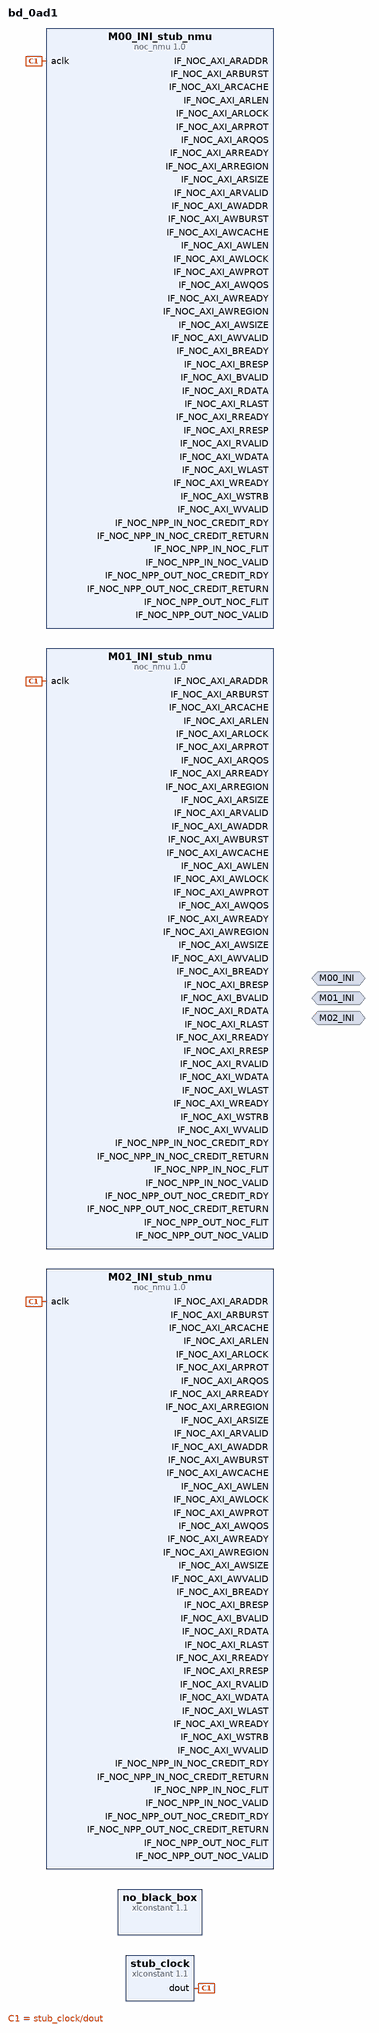
[diagram p0: block diagram of the top level]
# Vivado block design bd_0ad1, xcvc1902-vsvd1760-2MP-e-S, Vivado 2022.2
create_bd_design bd_0ad1

create_bd_intf_port -mode Master -vlnv xilinx.com:interface:inimm_rtl:1.0 M00_INI
set_property -dict {CONFIG.INI_STRATEGY load} [get_bd_intf_ports M00_INI]
create_bd_intf_port -mode Master -vlnv xilinx.com:interface:inimm_rtl:1.0 M01_INI
set_property -dict {CONFIG.INI_STRATEGY load} [get_bd_intf_ports M01_INI]
create_bd_intf_port -mode Master -vlnv xilinx.com:interface:inimm_rtl:1.0 M02_INI
set_property -dict {CONFIG.INI_STRATEGY load} [get_bd_intf_ports M02_INI]

create_bd_cell -type ip -vlnv xilinx.com:ip:noc_nmu:1.0 M02_INI_stub_nmu
set_property -dict [list \
  CONFIG.ATTR_FILE nocattrs.dat \
  CONFIG.NOC_FREQ 1000 \
  CONFIG.USER_PHYS_NAME NOC_NMU512_X3Y0 \
  CONFIG.USER_REG_ADDR_DST0 0x00000 \
  CONFIG.USER_REG_ADDR_DST1 0x00000 \
  CONFIG.USER_REG_ADDR_DST2 0x00000 \
  CONFIG.USER_REG_ADDR_DST3 0x00000 \
  CONFIG.USER_REG_ADDR_DST4 0x00000 \
  CONFIG.USER_REG_ADDR_DST5 0x00000 \
  CONFIG.USER_REG_ADDR_DST6 0x00000 \
  CONFIG.USER_REG_ADDR_DST7 0x00000 \
  CONFIG.USER_REG_ADDR_DST8 0x00000 \
  CONFIG.USER_REG_ADDR_DST9 0x00000 \
  CONFIG.USER_REG_ADDR_DST10 0x00000 \
  CONFIG.USER_REG_ADDR_DST11 0x00000 \
  CONFIG.USER_REG_ADDR_DST12 0x00000 \
  CONFIG.USER_REG_ADDR_DST13 0x00000 \
  CONFIG.USER_REG_ADDR_DST14 0x00000 \
  CONFIG.USER_REG_ADDR_DST15 0x00000 \
  CONFIG.USER_REG_ADDR_ENABLE 0x0000 \
  CONFIG.USER_REG_ADDR_MADDR0 0x00000000 \
  CONFIG.USER_REG_ADDR_MADDR1 0x00000000 \
  CONFIG.USER_REG_ADDR_MADDR2 0x00000000 \
  CONFIG.USER_REG_ADDR_MADDR3 0x00000000 \
  CONFIG.USER_REG_ADDR_MADDR4 0x00000000 \
  CONFIG.USER_REG_ADDR_MADDR5 0x00000000 \
  CONFIG.USER_REG_ADDR_MADDR6 0x00000000 \
  CONFIG.USER_REG_ADDR_MADDR7 0x00000000 \
  CONFIG.USER_REG_ADDR_MADDR8 0x00000000 \
  CONFIG.USER_REG_ADDR_MADDR9 0x00000000 \
  CONFIG.USER_REG_ADDR_MADDR10 0x00000000 \
  CONFIG.USER_REG_ADDR_MADDR11 0x00000000 \
  CONFIG.USER_REG_ADDR_MADDR12 0x00000000 \
  CONFIG.USER_REG_ADDR_MADDR13 0x00000000 \
  CONFIG.USER_REG_ADDR_MADDR14 0x00000000 \
  CONFIG.USER_REG_ADDR_MADDR15 0x00000000 \
  CONFIG.USER_REG_ADDR_MASK0 0x00000000 \
  CONFIG.USER_REG_ADDR_MASK1 0x00000000 \
  CONFIG.USER_REG_ADDR_MASK2 0x00000000 \
  CONFIG.USER_REG_ADDR_MASK3 0x00000000 \
  CONFIG.USER_REG_ADDR_MASK4 0x00000000 \
  CONFIG.USER_REG_ADDR_MASK5 0x00000000 \
  CONFIG.USER_REG_ADDR_MASK6 0x00000000 \
  CONFIG.USER_REG_ADDR_MASK7 0x00000000 \
  CONFIG.USER_REG_ADDR_MASK8 0x00000000 \
  CONFIG.USER_REG_ADDR_MASK9 0x00000000 \
  CONFIG.USER_REG_ADDR_MASK10 0x00000000 \
  CONFIG.USER_REG_ADDR_MASK11 0x00000000 \
  CONFIG.USER_REG_ADDR_MASK12 0x00000000 \
  CONFIG.USER_REG_ADDR_MASK13 0x00000000 \
  CONFIG.USER_REG_ADDR_MASK14 0x00000000 \
  CONFIG.USER_REG_ADDR_MASK15 0x00000000 \
  CONFIG.USER_REG_ADDR_REMAP 0x0000 \
  CONFIG.USER_REG_ADDR_RPADDR0 0x00000000 \
  CONFIG.USER_REG_ADDR_RPADDR1 0x00000000 \
  CONFIG.USER_REG_ADDR_RPADDR2 0x00000000 \
  CONFIG.USER_REG_ADDR_RPADDR3 0x00000000 \
  CONFIG.USER_REG_ADDR_RPADDR4 0x00000000 \
  CONFIG.USER_REG_ADDR_RPADDR5 0x00000000 \
  CONFIG.USER_REG_ADDR_RPADDR6 0x00000000 \
  CONFIG.USER_REG_ADDR_RPADDR7 0x00000000 \
  CONFIG.USER_REG_ADDR_RPADDR8 0x00000000 \
  CONFIG.USER_REG_ADDR_RPADDR9 0x00000000 \
  CONFIG.USER_REG_ADDR_RPADDR10 0x00000000 \
  CONFIG.USER_REG_ADDR_RPADDR11 0x00000000 \
  CONFIG.USER_REG_ADDR_RPADDR12 0x00000000 \
  CONFIG.USER_REG_ADDR_RPADDR13 0x00000000 \
  CONFIG.USER_REG_ADDR_RPADDR14 0x00000000 \
  CONFIG.USER_REG_ADDR_RPADDR15 0x00000000 \
  CONFIG.USER_REG_ADR_MAP_CPM 0x0FC0 \
  CONFIG.USER_REG_ADR_MAP_FPD_AFI_0 0x0FC0 \
  CONFIG.USER_REG_ADR_MAP_FPD_AFI_1 0x0FC0 \
  CONFIG.USER_REG_ADR_MAP_LPD_AFI_FS 0x0FC0 \
  CONFIG.USER_REG_ADR_MAP_ME_ARRAY_0 0x0FC0 \
  CONFIG.USER_REG_ADR_MAP_ME_ARRAY_1 0x0FC0 \
  CONFIG.USER_REG_ADR_MAP_ME_ARRAY_2 0x0FC0 \
  CONFIG.USER_REG_ADR_MAP_ME_ARRAY_3 0x0FC0 \
  CONFIG.USER_REG_ADR_MAP_PCIE 0x0FC0 \
  CONFIG.USER_REG_ADR_MAP_PMC 0x0FC0 \
  CONFIG.USER_REG_ADR_MAP_PMC_ALIAS_0 0x0FC0 \
  CONFIG.USER_REG_ADR_MAP_PMC_ALIAS_1 0x0FC0 \
  CONFIG.USER_REG_ADR_MAP_PMC_ALIAS_2 0x0FC0 \
  CONFIG.USER_REG_ADR_MAP_PMC_ALIAS_3 0x0FC0 \
  CONFIG.USER_REG_ADR_MAP_QSPI 0x0FC0 \
  CONFIG.USER_REG_ADR_MAP_STM_GIC 0x0FC0 \
  CONFIG.USER_REG_ADR_MAP_XPDS 0x0FC0 \
  CONFIG.USER_REG_AXI_LOOPBACK 0x00 \
  CONFIG.USER_REG_AXI_NON_MOD_DISABLE 0x0 \
  CONFIG.USER_REG_AXI_PAR_CHK 0x0 \
  CONFIG.USER_REG_CHOPSIZE 0xA \
  CONFIG.USER_REG_DDR_ADR_MAP0 0x06688 \
  CONFIG.USER_REG_DDR_ADR_MAP1 0x01FFF \
  CONFIG.USER_REG_DDR_ADR_MAP2 0x01FFF \
  CONFIG.USER_REG_DDR_ADR_MAP3 0x01FFF \
  CONFIG.USER_REG_DDR_ADR_MAP4 0x01FFF \
  CONFIG.USER_REG_DDR_ADR_MAP5 0x01FFF \
  CONFIG.USER_REG_DDR_ADR_MAP6 0x01FFF \
  CONFIG.USER_REG_DDR_DST_MAP0 0x900 \
  CONFIG.USER_REG_DDR_DST_MAP1 0x600 \
  CONFIG.USER_REG_DDR_DST_MAP2 0x800 \
  CONFIG.USER_REG_DDR_DST_MAP3 0x700 \
  CONFIG.USER_REG_DDR_DST_MAP4 0xFC0 \
  CONFIG.USER_REG_DDR_DST_MAP5 0xFC0 \
  CONFIG.USER_REG_DDR_DST_MAP6 0xFC0 \
  CONFIG.USER_REG_DDR_DST_MAP7 0xFC0 \
  CONFIG.USER_REG_DWIDTH 0x6 \
  CONFIG.USER_REG_ECC_CHK_EN 0x1 \
  CONFIG.USER_REG_HBM_MAP_T0_CH0 0x0FC0 \
  CONFIG.USER_REG_HBM_MAP_T0_CH1 0x0FC0 \
  CONFIG.USER_REG_HBM_MAP_T0_CH2 0x0FC0 \
  CONFIG.USER_REG_HBM_MAP_T0_CH3 0x0FC0 \
  CONFIG.USER_REG_HBM_MAP_T0_CH4 0x0FC0 \
  CONFIG.USER_REG_HBM_MAP_T0_CH5 0x0FC0 \
  CONFIG.USER_REG_HBM_MAP_T0_CH6 0x0FC0 \
  CONFIG.USER_REG_HBM_MAP_T0_CH7 0x0FC0 \
  CONFIG.USER_REG_HBM_MAP_T0_CH8 0x0FC0 \
  CONFIG.USER_REG_HBM_MAP_T0_CH9 0x0FC0 \
  CONFIG.USER_REG_HBM_MAP_T0_CH10 0x0FC0 \
  CONFIG.USER_REG_HBM_MAP_T0_CH11 0x0FC0 \
  CONFIG.USER_REG_HBM_MAP_T0_CH12 0x0FC0 \
  CONFIG.USER_REG_HBM_MAP_T0_CH13 0x0FC0 \
  CONFIG.USER_REG_HBM_MAP_T0_CH14 0x0FC0 \
  CONFIG.USER_REG_HBM_MAP_T0_CH15 0x0FC0 \
  CONFIG.USER_REG_HBM_MAP_T1_CH0 0x0FC0 \
  CONFIG.USER_REG_HBM_MAP_T1_CH1 0x0FC0 \
  CONFIG.USER_REG_HBM_MAP_T1_CH2 0x0FC0 \
  CONFIG.USER_REG_HBM_MAP_T1_CH3 0x0FC0 \
  CONFIG.USER_REG_HBM_MAP_T1_CH4 0x0FC0 \
  CONFIG.USER_REG_HBM_MAP_T1_CH5 0x0FC0 \
  CONFIG.USER_REG_HBM_MAP_T1_CH6 0x0FC0 \
  CONFIG.USER_REG_HBM_MAP_T1_CH7 0x0FC0 \
  CONFIG.USER_REG_HBM_MAP_T1_CH8 0x0FC0 \
  CONFIG.USER_REG_HBM_MAP_T1_CH9 0x0FC0 \
  CONFIG.USER_REG_HBM_MAP_T1_CH10 0x0FC0 \
  CONFIG.USER_REG_HBM_MAP_T1_CH11 0x0FC0 \
  CONFIG.USER_REG_HBM_MAP_T1_CH12 0x0FC0 \
  CONFIG.USER_REG_HBM_MAP_T1_CH13 0x0FC0 \
  CONFIG.USER_REG_HBM_MAP_T1_CH14 0x0FC0 \
  CONFIG.USER_REG_HBM_MAP_T1_CH15 0x0FC0 \
  CONFIG.USER_REG_HBM_MAP_T2_CH0 0x0FC0 \
  CONFIG.USER_REG_HBM_MAP_T2_CH1 0x0FC0 \
  CONFIG.USER_REG_HBM_MAP_T2_CH2 0x0FC0 \
  CONFIG.USER_REG_HBM_MAP_T2_CH3 0x0FC0 \
  CONFIG.USER_REG_HBM_MAP_T2_CH4 0x0FC0 \
  CONFIG.USER_REG_HBM_MAP_T2_CH5 0x0FC0 \
  CONFIG.USER_REG_HBM_MAP_T2_CH6 0x0FC0 \
  CONFIG.USER_REG_HBM_MAP_T2_CH7 0x0FC0 \
  CONFIG.USER_REG_HBM_MAP_T2_CH8 0x0FC0 \
  CONFIG.USER_REG_HBM_MAP_T2_CH9 0x0FC0 \
  CONFIG.USER_REG_HBM_MAP_T2_CH10 0x0FC0 \
  CONFIG.USER_REG_HBM_MAP_T2_CH11 0x0FC0 \
  CONFIG.USER_REG_HBM_MAP_T2_CH12 0x0FC0 \
  CONFIG.USER_REG_HBM_MAP_T2_CH13 0x0FC0 \
  CONFIG.USER_REG_HBM_MAP_T2_CH14 0x0FC0 \
  CONFIG.USER_REG_HBM_MAP_T2_CH15 0x0FC0 \
  CONFIG.USER_REG_HBM_MAP_T3_CH0 0x0FC0 \
  CONFIG.USER_REG_HBM_MAP_T3_CH1 0x0FC0 \
  CONFIG.USER_REG_HBM_MAP_T3_CH2 0x0FC0 \
  CONFIG.USER_REG_HBM_MAP_T3_CH3 0x0FC0 \
  CONFIG.USER_REG_HBM_MAP_T3_CH4 0x0FC0 \
  CONFIG.USER_REG_HBM_MAP_T3_CH5 0x0FC0 \
  CONFIG.USER_REG_HBM_MAP_T3_CH6 0x0FC0 \
  CONFIG.USER_REG_HBM_MAP_T3_CH7 0x0FC0 \
  CONFIG.USER_REG_HBM_MAP_T3_CH8 0x0FC0 \
  CONFIG.USER_REG_HBM_MAP_T3_CH9 0x0FC0 \
  CONFIG.USER_REG_HBM_MAP_T3_CH10 0x0FC0 \
  CONFIG.USER_REG_HBM_MAP_T3_CH11 0x0FC0 \
  CONFIG.USER_REG_HBM_MAP_T3_CH12 0x0FC0 \
  CONFIG.USER_REG_HBM_MAP_T3_CH13 0x0FC0 \
  CONFIG.USER_REG_HBM_MAP_T3_CH14 0x0FC0 \
  CONFIG.USER_REG_HBM_MAP_T3_CH15 0x0FC0 \
  CONFIG.USER_REG_MODE_SELECT 0x0000 \
  CONFIG.USER_REG_OUTSTANDING_RD_TXN 0x40 \
  CONFIG.USER_REG_OUTSTANDING_WR_TXN 0x40 \
  CONFIG.USER_REG_PRIORITY 0x0 \
  CONFIG.USER_REG_RD_AXPROT_SEL 0x00 \
  CONFIG.USER_REG_RD_RATE_CREDIT_DROP 0x004 \
  CONFIG.USER_REG_RD_RATE_CREDIT_LIMIT 0x0100 \
  CONFIG.USER_REG_RD_VCA_TOKEN0 0x14 \
  CONFIG.USER_REG_RPOISON_TO_SLVERR 0x0 \
  CONFIG.USER_REG_RROB_RAM_SETTING 0x012 \
  CONFIG.USER_REG_SMID_SEL 0x00000 \
  CONFIG.USER_REG_SRC 0x200 \
  CONFIG.USER_REG_TBASE_AXI_TIMEOUT 0x1 \
  CONFIG.USER_REG_TBASE_MODE_RLIMIT_RD 0x2 \
  CONFIG.USER_REG_TBASE_MODE_RLIMIT_WR 0x2 \
  CONFIG.USER_REG_TBASE_TRK_TIMEOUT 0x1 \
  CONFIG.USER_REG_VC_MAP 0x688 \
  CONFIG.USER_REG_WBUF_LAUNCH_SIZE 0x10 \
  CONFIG.USER_REG_WBUF_RAM_SETTING 0x012 \
  CONFIG.USER_REG_WR_AXPROT_SEL 0x00 \
  CONFIG.USER_REG_WR_RATE_CREDIT_DROP 0x004 \
  CONFIG.USER_REG_WR_RATE_CREDIT_LIMIT 0x0100 \
  CONFIG.USER_REG_WR_VCA_TOKEN0 0xFF \
] [get_bd_cells M02_INI_stub_nmu]
create_bd_cell -type ip -vlnv xilinx.com:ip:noc_nmu:1.0 M00_INI_stub_nmu
set_property -dict [list \
  CONFIG.ATTR_FILE nocattrs.dat \
  CONFIG.NOC_FREQ 1000 \
  CONFIG.USER_PHYS_NAME NOC_NMU512_X0Y0 \
  CONFIG.USER_REG_ADDR_DST0 0x00000 \
  CONFIG.USER_REG_ADDR_DST1 0x00000 \
  CONFIG.USER_REG_ADDR_DST2 0x00000 \
  CONFIG.USER_REG_ADDR_DST3 0x00000 \
  CONFIG.USER_REG_ADDR_DST4 0x00000 \
  CONFIG.USER_REG_ADDR_DST5 0x00000 \
  CONFIG.USER_REG_ADDR_DST6 0x00000 \
  CONFIG.USER_REG_ADDR_DST7 0x00000 \
  CONFIG.USER_REG_ADDR_DST8 0x00000 \
  CONFIG.USER_REG_ADDR_DST9 0x00000 \
  CONFIG.USER_REG_ADDR_DST10 0x00000 \
  CONFIG.USER_REG_ADDR_DST11 0x00000 \
  CONFIG.USER_REG_ADDR_DST12 0x00000 \
  CONFIG.USER_REG_ADDR_DST13 0x00000 \
  CONFIG.USER_REG_ADDR_DST14 0x00000 \
  CONFIG.USER_REG_ADDR_DST15 0x00000 \
  CONFIG.USER_REG_ADDR_ENABLE 0x0000 \
  CONFIG.USER_REG_ADDR_MADDR0 0x00000000 \
  CONFIG.USER_REG_ADDR_MADDR1 0x00000000 \
  CONFIG.USER_REG_ADDR_MADDR2 0x00000000 \
  CONFIG.USER_REG_ADDR_MADDR3 0x00000000 \
  CONFIG.USER_REG_ADDR_MADDR4 0x00000000 \
  CONFIG.USER_REG_ADDR_MADDR5 0x00000000 \
  CONFIG.USER_REG_ADDR_MADDR6 0x00000000 \
  CONFIG.USER_REG_ADDR_MADDR7 0x00000000 \
  CONFIG.USER_REG_ADDR_MADDR8 0x00000000 \
  CONFIG.USER_REG_ADDR_MADDR9 0x00000000 \
  CONFIG.USER_REG_ADDR_MADDR10 0x00000000 \
  CONFIG.USER_REG_ADDR_MADDR11 0x00000000 \
  CONFIG.USER_REG_ADDR_MADDR12 0x00000000 \
  CONFIG.USER_REG_ADDR_MADDR13 0x00000000 \
  CONFIG.USER_REG_ADDR_MADDR14 0x00000000 \
  CONFIG.USER_REG_ADDR_MADDR15 0x00000000 \
  CONFIG.USER_REG_ADDR_MASK0 0x00000000 \
  CONFIG.USER_REG_ADDR_MASK1 0x00000000 \
  CONFIG.USER_REG_ADDR_MASK2 0x00000000 \
  CONFIG.USER_REG_ADDR_MASK3 0x00000000 \
  CONFIG.USER_REG_ADDR_MASK4 0x00000000 \
  CONFIG.USER_REG_ADDR_MASK5 0x00000000 \
  CONFIG.USER_REG_ADDR_MASK6 0x00000000 \
  CONFIG.USER_REG_ADDR_MASK7 0x00000000 \
  CONFIG.USER_REG_ADDR_MASK8 0x00000000 \
  CONFIG.USER_REG_ADDR_MASK9 0x00000000 \
  CONFIG.USER_REG_ADDR_MASK10 0x00000000 \
  CONFIG.USER_REG_ADDR_MASK11 0x00000000 \
  CONFIG.USER_REG_ADDR_MASK12 0x00000000 \
  CONFIG.USER_REG_ADDR_MASK13 0x00000000 \
  CONFIG.USER_REG_ADDR_MASK14 0x00000000 \
  CONFIG.USER_REG_ADDR_MASK15 0x00000000 \
  CONFIG.USER_REG_ADDR_REMAP 0x0000 \
  CONFIG.USER_REG_ADDR_RPADDR0 0x00000000 \
  CONFIG.USER_REG_ADDR_RPADDR1 0x00000000 \
  CONFIG.USER_REG_ADDR_RPADDR2 0x00000000 \
  CONFIG.USER_REG_ADDR_RPADDR3 0x00000000 \
  CONFIG.USER_REG_ADDR_RPADDR4 0x00000000 \
  CONFIG.USER_REG_ADDR_RPADDR5 0x00000000 \
  CONFIG.USER_REG_ADDR_RPADDR6 0x00000000 \
  CONFIG.USER_REG_ADDR_RPADDR7 0x00000000 \
  CONFIG.USER_REG_ADDR_RPADDR8 0x00000000 \
  CONFIG.USER_REG_ADDR_RPADDR9 0x00000000 \
  CONFIG.USER_REG_ADDR_RPADDR10 0x00000000 \
  CONFIG.USER_REG_ADDR_RPADDR11 0x00000000 \
  CONFIG.USER_REG_ADDR_RPADDR12 0x00000000 \
  CONFIG.USER_REG_ADDR_RPADDR13 0x00000000 \
  CONFIG.USER_REG_ADDR_RPADDR14 0x00000000 \
  CONFIG.USER_REG_ADDR_RPADDR15 0x00000000 \
  CONFIG.USER_REG_ADR_MAP_CPM 0x0FC0 \
  CONFIG.USER_REG_ADR_MAP_FPD_AFI_0 0x0FC0 \
  CONFIG.USER_REG_ADR_MAP_FPD_AFI_1 0x0FC0 \
  CONFIG.USER_REG_ADR_MAP_LPD_AFI_FS 0x0FC0 \
  CONFIG.USER_REG_ADR_MAP_ME_ARRAY_0 0x0FC0 \
  CONFIG.USER_REG_ADR_MAP_ME_ARRAY_1 0x0FC0 \
  CONFIG.USER_REG_ADR_MAP_ME_ARRAY_2 0x0FC0 \
  CONFIG.USER_REG_ADR_MAP_ME_ARRAY_3 0x0FC0 \
  CONFIG.USER_REG_ADR_MAP_PCIE 0x0FC0 \
  CONFIG.USER_REG_ADR_MAP_PMC 0x0FC0 \
  CONFIG.USER_REG_ADR_MAP_PMC_ALIAS_0 0x0FC0 \
  CONFIG.USER_REG_ADR_MAP_PMC_ALIAS_1 0x0FC0 \
  CONFIG.USER_REG_ADR_MAP_PMC_ALIAS_2 0x0FC0 \
  CONFIG.USER_REG_ADR_MAP_PMC_ALIAS_3 0x0FC0 \
  CONFIG.USER_REG_ADR_MAP_QSPI 0x0FC0 \
  CONFIG.USER_REG_ADR_MAP_STM_GIC 0x0FC0 \
  CONFIG.USER_REG_ADR_MAP_XPDS 0x0FC0 \
  CONFIG.USER_REG_AXI_LOOPBACK 0x00 \
  CONFIG.USER_REG_AXI_NON_MOD_DISABLE 0x0 \
  CONFIG.USER_REG_AXI_PAR_CHK 0x0 \
  CONFIG.USER_REG_CHOPSIZE 0xA \
  CONFIG.USER_REG_DDR_ADR_MAP0 0x06688 \
  CONFIG.USER_REG_DDR_ADR_MAP1 0x01FFF \
  CONFIG.USER_REG_DDR_ADR_MAP2 0x01FFF \
  CONFIG.USER_REG_DDR_ADR_MAP3 0x01FFF \
  CONFIG.USER_REG_DDR_ADR_MAP4 0x01FFF \
  CONFIG.USER_REG_DDR_ADR_MAP5 0x01FFF \
  CONFIG.USER_REG_DDR_ADR_MAP6 0x01FFF \
  CONFIG.USER_REG_DDR_DST_MAP0 0x880 \
  CONFIG.USER_REG_DDR_DST_MAP1 0x580 \
  CONFIG.USER_REG_DDR_DST_MAP2 0x780 \
  CONFIG.USER_REG_DDR_DST_MAP3 0x680 \
  CONFIG.USER_REG_DDR_DST_MAP4 0xFC0 \
  CONFIG.USER_REG_DDR_DST_MAP5 0xFC0 \
  CONFIG.USER_REG_DDR_DST_MAP6 0xFC0 \
  CONFIG.USER_REG_DDR_DST_MAP7 0xFC0 \
  CONFIG.USER_REG_DWIDTH 0x6 \
  CONFIG.USER_REG_ECC_CHK_EN 0x1 \
  CONFIG.USER_REG_HBM_MAP_T0_CH0 0x0FC0 \
  CONFIG.USER_REG_HBM_MAP_T0_CH1 0x0FC0 \
  CONFIG.USER_REG_HBM_MAP_T0_CH2 0x0FC0 \
  CONFIG.USER_REG_HBM_MAP_T0_CH3 0x0FC0 \
  CONFIG.USER_REG_HBM_MAP_T0_CH4 0x0FC0 \
  CONFIG.USER_REG_HBM_MAP_T0_CH5 0x0FC0 \
  CONFIG.USER_REG_HBM_MAP_T0_CH6 0x0FC0 \
  CONFIG.USER_REG_HBM_MAP_T0_CH7 0x0FC0 \
  CONFIG.USER_REG_HBM_MAP_T0_CH8 0x0FC0 \
  CONFIG.USER_REG_HBM_MAP_T0_CH9 0x0FC0 \
  CONFIG.USER_REG_HBM_MAP_T0_CH10 0x0FC0 \
  CONFIG.USER_REG_HBM_MAP_T0_CH11 0x0FC0 \
  CONFIG.USER_REG_HBM_MAP_T0_CH12 0x0FC0 \
  CONFIG.USER_REG_HBM_MAP_T0_CH13 0x0FC0 \
  CONFIG.USER_REG_HBM_MAP_T0_CH14 0x0FC0 \
  CONFIG.USER_REG_HBM_MAP_T0_CH15 0x0FC0 \
  CONFIG.USER_REG_HBM_MAP_T1_CH0 0x0FC0 \
  CONFIG.USER_REG_HBM_MAP_T1_CH1 0x0FC0 \
  CONFIG.USER_REG_HBM_MAP_T1_CH2 0x0FC0 \
  CONFIG.USER_REG_HBM_MAP_T1_CH3 0x0FC0 \
  CONFIG.USER_REG_HBM_MAP_T1_CH4 0x0FC0 \
  CONFIG.USER_REG_HBM_MAP_T1_CH5 0x0FC0 \
  CONFIG.USER_REG_HBM_MAP_T1_CH6 0x0FC0 \
  CONFIG.USER_REG_HBM_MAP_T1_CH7 0x0FC0 \
  CONFIG.USER_REG_HBM_MAP_T1_CH8 0x0FC0 \
  CONFIG.USER_REG_HBM_MAP_T1_CH9 0x0FC0 \
  CONFIG.USER_REG_HBM_MAP_T1_CH10 0x0FC0 \
  CONFIG.USER_REG_HBM_MAP_T1_CH11 0x0FC0 \
  CONFIG.USER_REG_HBM_MAP_T1_CH12 0x0FC0 \
  CONFIG.USER_REG_HBM_MAP_T1_CH13 0x0FC0 \
  CONFIG.USER_REG_HBM_MAP_T1_CH14 0x0FC0 \
  CONFIG.USER_REG_HBM_MAP_T1_CH15 0x0FC0 \
  CONFIG.USER_REG_HBM_MAP_T2_CH0 0x0FC0 \
  CONFIG.USER_REG_HBM_MAP_T2_CH1 0x0FC0 \
  CONFIG.USER_REG_HBM_MAP_T2_CH2 0x0FC0 \
  CONFIG.USER_REG_HBM_MAP_T2_CH3 0x0FC0 \
  CONFIG.USER_REG_HBM_MAP_T2_CH4 0x0FC0 \
  CONFIG.USER_REG_HBM_MAP_T2_CH5 0x0FC0 \
  CONFIG.USER_REG_HBM_MAP_T2_CH6 0x0FC0 \
  CONFIG.USER_REG_HBM_MAP_T2_CH7 0x0FC0 \
  CONFIG.USER_REG_HBM_MAP_T2_CH8 0x0FC0 \
  CONFIG.USER_REG_HBM_MAP_T2_CH9 0x0FC0 \
  CONFIG.USER_REG_HBM_MAP_T2_CH10 0x0FC0 \
  CONFIG.USER_REG_HBM_MAP_T2_CH11 0x0FC0 \
  CONFIG.USER_REG_HBM_MAP_T2_CH12 0x0FC0 \
  CONFIG.USER_REG_HBM_MAP_T2_CH13 0x0FC0 \
  CONFIG.USER_REG_HBM_MAP_T2_CH14 0x0FC0 \
  CONFIG.USER_REG_HBM_MAP_T2_CH15 0x0FC0 \
  CONFIG.USER_REG_HBM_MAP_T3_CH0 0x0FC0 \
  CONFIG.USER_REG_HBM_MAP_T3_CH1 0x0FC0 \
  CONFIG.USER_REG_HBM_MAP_T3_CH2 0x0FC0 \
  CONFIG.USER_REG_HBM_MAP_T3_CH3 0x0FC0 \
  CONFIG.USER_REG_HBM_MAP_T3_CH4 0x0FC0 \
  CONFIG.USER_REG_HBM_MAP_T3_CH5 0x0FC0 \
  CONFIG.USER_REG_HBM_MAP_T3_CH6 0x0FC0 \
  CONFIG.USER_REG_HBM_MAP_T3_CH7 0x0FC0 \
  CONFIG.USER_REG_HBM_MAP_T3_CH8 0x0FC0 \
  CONFIG.USER_REG_HBM_MAP_T3_CH9 0x0FC0 \
  CONFIG.USER_REG_HBM_MAP_T3_CH10 0x0FC0 \
  CONFIG.USER_REG_HBM_MAP_T3_CH11 0x0FC0 \
  CONFIG.USER_REG_HBM_MAP_T3_CH12 0x0FC0 \
  CONFIG.USER_REG_HBM_MAP_T3_CH13 0x0FC0 \
  CONFIG.USER_REG_HBM_MAP_T3_CH14 0x0FC0 \
  CONFIG.USER_REG_HBM_MAP_T3_CH15 0x0FC0 \
  CONFIG.USER_REG_MODE_SELECT 0x0000 \
  CONFIG.USER_REG_OUTSTANDING_RD_TXN 0x40 \
  CONFIG.USER_REG_OUTSTANDING_WR_TXN 0x40 \
  CONFIG.USER_REG_PRIORITY 0x0 \
  CONFIG.USER_REG_RD_AXPROT_SEL 0x00 \
  CONFIG.USER_REG_RD_RATE_CREDIT_DROP 0x004 \
  CONFIG.USER_REG_RD_RATE_CREDIT_LIMIT 0x0100 \
  CONFIG.USER_REG_RD_VCA_TOKEN0 0x14 \
  CONFIG.USER_REG_RPOISON_TO_SLVERR 0x0 \
  CONFIG.USER_REG_RROB_RAM_SETTING 0x012 \
  CONFIG.USER_REG_SMID_SEL 0x00000 \
  CONFIG.USER_REG_SRC 0x140 \
  CONFIG.USER_REG_TBASE_AXI_TIMEOUT 0x1 \
  CONFIG.USER_REG_TBASE_MODE_RLIMIT_RD 0x2 \
  CONFIG.USER_REG_TBASE_MODE_RLIMIT_WR 0x2 \
  CONFIG.USER_REG_TBASE_TRK_TIMEOUT 0x1 \
  CONFIG.USER_REG_VC_MAP 0xEA8 \
  CONFIG.USER_REG_WBUF_LAUNCH_SIZE 0x10 \
  CONFIG.USER_REG_WBUF_RAM_SETTING 0x012 \
  CONFIG.USER_REG_WR_AXPROT_SEL 0x00 \
  CONFIG.USER_REG_WR_RATE_CREDIT_DROP 0x004 \
  CONFIG.USER_REG_WR_RATE_CREDIT_LIMIT 0x0100 \
  CONFIG.USER_REG_WR_VCA_TOKEN0 0xFF \
] [get_bd_cells M00_INI_stub_nmu]
create_bd_cell -type ip -vlnv xilinx.com:ip:noc_nmu:1.0 M01_INI_stub_nmu
set_property -dict [list \
  CONFIG.ATTR_FILE nocattrs.dat \
  CONFIG.NOC_FREQ 1000 \
  CONFIG.USER_PHYS_NAME NOC_NMU512_X1Y1 \
  CONFIG.USER_REG_ADDR_DST0 0x00000 \
  CONFIG.USER_REG_ADDR_DST1 0x00000 \
  CONFIG.USER_REG_ADDR_DST2 0x00000 \
  CONFIG.USER_REG_ADDR_DST3 0x00000 \
  CONFIG.USER_REG_ADDR_DST4 0x00000 \
  CONFIG.USER_REG_ADDR_DST5 0x00000 \
  CONFIG.USER_REG_ADDR_DST6 0x00000 \
  CONFIG.USER_REG_ADDR_DST7 0x00000 \
  CONFIG.USER_REG_ADDR_DST8 0x00000 \
  CONFIG.USER_REG_ADDR_DST9 0x00000 \
  CONFIG.USER_REG_ADDR_DST10 0x00000 \
  CONFIG.USER_REG_ADDR_DST11 0x00000 \
  CONFIG.USER_REG_ADDR_DST12 0x00000 \
  CONFIG.USER_REG_ADDR_DST13 0x00000 \
  CONFIG.USER_REG_ADDR_DST14 0x00000 \
  CONFIG.USER_REG_ADDR_DST15 0x00000 \
  CONFIG.USER_REG_ADDR_ENABLE 0x0000 \
  CONFIG.USER_REG_ADDR_MADDR0 0x00000000 \
  CONFIG.USER_REG_ADDR_MADDR1 0x00000000 \
  CONFIG.USER_REG_ADDR_MADDR2 0x00000000 \
  CONFIG.USER_REG_ADDR_MADDR3 0x00000000 \
  CONFIG.USER_REG_ADDR_MADDR4 0x00000000 \
  CONFIG.USER_REG_ADDR_MADDR5 0x00000000 \
  CONFIG.USER_REG_ADDR_MADDR6 0x00000000 \
  CONFIG.USER_REG_ADDR_MADDR7 0x00000000 \
  CONFIG.USER_REG_ADDR_MADDR8 0x00000000 \
  CONFIG.USER_REG_ADDR_MADDR9 0x00000000 \
  CONFIG.USER_REG_ADDR_MADDR10 0x00000000 \
  CONFIG.USER_REG_ADDR_MADDR11 0x00000000 \
  CONFIG.USER_REG_ADDR_MADDR12 0x00000000 \
  CONFIG.USER_REG_ADDR_MADDR13 0x00000000 \
  CONFIG.USER_REG_ADDR_MADDR14 0x00000000 \
  CONFIG.USER_REG_ADDR_MADDR15 0x00000000 \
  CONFIG.USER_REG_ADDR_MASK0 0x00000000 \
  CONFIG.USER_REG_ADDR_MASK1 0x00000000 \
  CONFIG.USER_REG_ADDR_MASK2 0x00000000 \
  CONFIG.USER_REG_ADDR_MASK3 0x00000000 \
  CONFIG.USER_REG_ADDR_MASK4 0x00000000 \
  CONFIG.USER_REG_ADDR_MASK5 0x00000000 \
  CONFIG.USER_REG_ADDR_MASK6 0x00000000 \
  CONFIG.USER_REG_ADDR_MASK7 0x00000000 \
  CONFIG.USER_REG_ADDR_MASK8 0x00000000 \
  CONFIG.USER_REG_ADDR_MASK9 0x00000000 \
  CONFIG.USER_REG_ADDR_MASK10 0x00000000 \
  CONFIG.USER_REG_ADDR_MASK11 0x00000000 \
  CONFIG.USER_REG_ADDR_MASK12 0x00000000 \
  CONFIG.USER_REG_ADDR_MASK13 0x00000000 \
  CONFIG.USER_REG_ADDR_MASK14 0x00000000 \
  CONFIG.USER_REG_ADDR_MASK15 0x00000000 \
  CONFIG.USER_REG_ADDR_REMAP 0x0000 \
  CONFIG.USER_REG_ADDR_RPADDR0 0x00000000 \
  CONFIG.USER_REG_ADDR_RPADDR1 0x00000000 \
  CONFIG.USER_REG_ADDR_RPADDR2 0x00000000 \
  CONFIG.USER_REG_ADDR_RPADDR3 0x00000000 \
  CONFIG.USER_REG_ADDR_RPADDR4 0x00000000 \
  CONFIG.USER_REG_ADDR_RPADDR5 0x00000000 \
  CONFIG.USER_REG_ADDR_RPADDR6 0x00000000 \
  CONFIG.USER_REG_ADDR_RPADDR7 0x00000000 \
  CONFIG.USER_REG_ADDR_RPADDR8 0x00000000 \
  CONFIG.USER_REG_ADDR_RPADDR9 0x00000000 \
  CONFIG.USER_REG_ADDR_RPADDR10 0x00000000 \
  CONFIG.USER_REG_ADDR_RPADDR11 0x00000000 \
  CONFIG.USER_REG_ADDR_RPADDR12 0x00000000 \
  CONFIG.USER_REG_ADDR_RPADDR13 0x00000000 \
  CONFIG.USER_REG_ADDR_RPADDR14 0x00000000 \
  CONFIG.USER_REG_ADDR_RPADDR15 0x00000000 \
  CONFIG.USER_REG_ADR_MAP_CPM 0x0FC0 \
  CONFIG.USER_REG_ADR_MAP_FPD_AFI_0 0x0FC0 \
  CONFIG.USER_REG_ADR_MAP_FPD_AFI_1 0x0FC0 \
  CONFIG.USER_REG_ADR_MAP_LPD_AFI_FS 0x0FC0 \
  CONFIG.USER_REG_ADR_MAP_ME_ARRAY_0 0x0FC0 \
  CONFIG.USER_REG_ADR_MAP_ME_ARRAY_1 0x0FC0 \
  CONFIG.USER_REG_ADR_MAP_ME_ARRAY_2 0x0FC0 \
  CONFIG.USER_REG_ADR_MAP_ME_ARRAY_3 0x0FC0 \
  CONFIG.USER_REG_ADR_MAP_PCIE 0x0FC0 \
  CONFIG.USER_REG_ADR_MAP_PMC 0x0FC0 \
  CONFIG.USER_REG_ADR_MAP_PMC_ALIAS_0 0x0FC0 \
  CONFIG.USER_REG_ADR_MAP_PMC_ALIAS_1 0x0FC0 \
  CONFIG.USER_REG_ADR_MAP_PMC_ALIAS_2 0x0FC0 \
  CONFIG.USER_REG_ADR_MAP_PMC_ALIAS_3 0x0FC0 \
  CONFIG.USER_REG_ADR_MAP_QSPI 0x0FC0 \
  CONFIG.USER_REG_ADR_MAP_STM_GIC 0x0FC0 \
  CONFIG.USER_REG_ADR_MAP_XPDS 0x0FC0 \
  CONFIG.USER_REG_AXI_LOOPBACK 0x00 \
  CONFIG.USER_REG_AXI_NON_MOD_DISABLE 0x0 \
  CONFIG.USER_REG_AXI_PAR_CHK 0x0 \
  CONFIG.USER_REG_CHOPSIZE 0xA \
  CONFIG.USER_REG_DDR_ADR_MAP0 0x06688 \
  CONFIG.USER_REG_DDR_ADR_MAP1 0x01FFF \
  CONFIG.USER_REG_DDR_ADR_MAP2 0x01FFF \
  CONFIG.USER_REG_DDR_ADR_MAP3 0x01FFF \
  CONFIG.USER_REG_DDR_ADR_MAP4 0x01FFF \
  CONFIG.USER_REG_DDR_ADR_MAP5 0x01FFF \
  CONFIG.USER_REG_DDR_ADR_MAP6 0x01FFF \
  CONFIG.USER_REG_DDR_DST_MAP0 0x8C0 \
  CONFIG.USER_REG_DDR_DST_MAP1 0x5C0 \
  CONFIG.USER_REG_DDR_DST_MAP2 0x7C0 \
  CONFIG.USER_REG_DDR_DST_MAP3 0x6C0 \
  CONFIG.USER_REG_DDR_DST_MAP4 0xFC0 \
  CONFIG.USER_REG_DDR_DST_MAP5 0xFC0 \
  CONFIG.USER_REG_DDR_DST_MAP6 0xFC0 \
  CONFIG.USER_REG_DDR_DST_MAP7 0xFC0 \
  CONFIG.USER_REG_DWIDTH 0x6 \
  CONFIG.USER_REG_ECC_CHK_EN 0x1 \
  CONFIG.USER_REG_HBM_MAP_T0_CH0 0x0FC0 \
  CONFIG.USER_REG_HBM_MAP_T0_CH1 0x0FC0 \
  CONFIG.USER_REG_HBM_MAP_T0_CH2 0x0FC0 \
  CONFIG.USER_REG_HBM_MAP_T0_CH3 0x0FC0 \
  CONFIG.USER_REG_HBM_MAP_T0_CH4 0x0FC0 \
  CONFIG.USER_REG_HBM_MAP_T0_CH5 0x0FC0 \
  CONFIG.USER_REG_HBM_MAP_T0_CH6 0x0FC0 \
  CONFIG.USER_REG_HBM_MAP_T0_CH7 0x0FC0 \
  CONFIG.USER_REG_HBM_MAP_T0_CH8 0x0FC0 \
  CONFIG.USER_REG_HBM_MAP_T0_CH9 0x0FC0 \
  CONFIG.USER_REG_HBM_MAP_T0_CH10 0x0FC0 \
  CONFIG.USER_REG_HBM_MAP_T0_CH11 0x0FC0 \
  CONFIG.USER_REG_HBM_MAP_T0_CH12 0x0FC0 \
  CONFIG.USER_REG_HBM_MAP_T0_CH13 0x0FC0 \
  CONFIG.USER_REG_HBM_MAP_T0_CH14 0x0FC0 \
  CONFIG.USER_REG_HBM_MAP_T0_CH15 0x0FC0 \
  CONFIG.USER_REG_HBM_MAP_T1_CH0 0x0FC0 \
  CONFIG.USER_REG_HBM_MAP_T1_CH1 0x0FC0 \
  CONFIG.USER_REG_HBM_MAP_T1_CH2 0x0FC0 \
  CONFIG.USER_REG_HBM_MAP_T1_CH3 0x0FC0 \
  CONFIG.USER_REG_HBM_MAP_T1_CH4 0x0FC0 \
  CONFIG.USER_REG_HBM_MAP_T1_CH5 0x0FC0 \
  CONFIG.USER_REG_HBM_MAP_T1_CH6 0x0FC0 \
  CONFIG.USER_REG_HBM_MAP_T1_CH7 0x0FC0 \
  CONFIG.USER_REG_HBM_MAP_T1_CH8 0x0FC0 \
  CONFIG.USER_REG_HBM_MAP_T1_CH9 0x0FC0 \
  CONFIG.USER_REG_HBM_MAP_T1_CH10 0x0FC0 \
  CONFIG.USER_REG_HBM_MAP_T1_CH11 0x0FC0 \
  CONFIG.USER_REG_HBM_MAP_T1_CH12 0x0FC0 \
  CONFIG.USER_REG_HBM_MAP_T1_CH13 0x0FC0 \
  CONFIG.USER_REG_HBM_MAP_T1_CH14 0x0FC0 \
  CONFIG.USER_REG_HBM_MAP_T1_CH15 0x0FC0 \
  CONFIG.USER_REG_HBM_MAP_T2_CH0 0x0FC0 \
  CONFIG.USER_REG_HBM_MAP_T2_CH1 0x0FC0 \
  CONFIG.USER_REG_HBM_MAP_T2_CH2 0x0FC0 \
  CONFIG.USER_REG_HBM_MAP_T2_CH3 0x0FC0 \
  CONFIG.USER_REG_HBM_MAP_T2_CH4 0x0FC0 \
  CONFIG.USER_REG_HBM_MAP_T2_CH5 0x0FC0 \
  CONFIG.USER_REG_HBM_MAP_T2_CH6 0x0FC0 \
  CONFIG.USER_REG_HBM_MAP_T2_CH7 0x0FC0 \
  CONFIG.USER_REG_HBM_MAP_T2_CH8 0x0FC0 \
  CONFIG.USER_REG_HBM_MAP_T2_CH9 0x0FC0 \
  CONFIG.USER_REG_HBM_MAP_T2_CH10 0x0FC0 \
  CONFIG.USER_REG_HBM_MAP_T2_CH11 0x0FC0 \
  CONFIG.USER_REG_HBM_MAP_T2_CH12 0x0FC0 \
  CONFIG.USER_REG_HBM_MAP_T2_CH13 0x0FC0 \
  CONFIG.USER_REG_HBM_MAP_T2_CH14 0x0FC0 \
  CONFIG.USER_REG_HBM_MAP_T2_CH15 0x0FC0 \
  CONFIG.USER_REG_HBM_MAP_T3_CH0 0x0FC0 \
  CONFIG.USER_REG_HBM_MAP_T3_CH1 0x0FC0 \
  CONFIG.USER_REG_HBM_MAP_T3_CH2 0x0FC0 \
  CONFIG.USER_REG_HBM_MAP_T3_CH3 0x0FC0 \
  CONFIG.USER_REG_HBM_MAP_T3_CH4 0x0FC0 \
  CONFIG.USER_REG_HBM_MAP_T3_CH5 0x0FC0 \
  CONFIG.USER_REG_HBM_MAP_T3_CH6 0x0FC0 \
  CONFIG.USER_REG_HBM_MAP_T3_CH7 0x0FC0 \
  CONFIG.USER_REG_HBM_MAP_T3_CH8 0x0FC0 \
  CONFIG.USER_REG_HBM_MAP_T3_CH9 0x0FC0 \
  CONFIG.USER_REG_HBM_MAP_T3_CH10 0x0FC0 \
  CONFIG.USER_REG_HBM_MAP_T3_CH11 0x0FC0 \
  CONFIG.USER_REG_HBM_MAP_T3_CH12 0x0FC0 \
  CONFIG.USER_REG_HBM_MAP_T3_CH13 0x0FC0 \
  CONFIG.USER_REG_HBM_MAP_T3_CH14 0x0FC0 \
  CONFIG.USER_REG_HBM_MAP_T3_CH15 0x0FC0 \
  CONFIG.USER_REG_MODE_SELECT 0x0000 \
  CONFIG.USER_REG_OUTSTANDING_RD_TXN 0x40 \
  CONFIG.USER_REG_OUTSTANDING_WR_TXN 0x40 \
  CONFIG.USER_REG_PRIORITY 0x0 \
  CONFIG.USER_REG_RD_AXPROT_SEL 0x00 \
  CONFIG.USER_REG_RD_RATE_CREDIT_DROP 0x004 \
  CONFIG.USER_REG_RD_RATE_CREDIT_LIMIT 0x0100 \
  CONFIG.USER_REG_RD_VCA_TOKEN0 0x14 \
  CONFIG.USER_REG_RPOISON_TO_SLVERR 0x0 \
  CONFIG.USER_REG_RROB_RAM_SETTING 0x012 \
  CONFIG.USER_REG_SMID_SEL 0x00000 \
  CONFIG.USER_REG_SRC 0x080 \
  CONFIG.USER_REG_TBASE_AXI_TIMEOUT 0x1 \
  CONFIG.USER_REG_TBASE_MODE_RLIMIT_RD 0x2 \
  CONFIG.USER_REG_TBASE_MODE_RLIMIT_WR 0x2 \
  CONFIG.USER_REG_TBASE_TRK_TIMEOUT 0x1 \
  CONFIG.USER_REG_VC_MAP 0xFAC \
  CONFIG.USER_REG_WBUF_LAUNCH_SIZE 0x10 \
  CONFIG.USER_REG_WBUF_RAM_SETTING 0x012 \
  CONFIG.USER_REG_WR_AXPROT_SEL 0x00 \
  CONFIG.USER_REG_WR_RATE_CREDIT_DROP 0x004 \
  CONFIG.USER_REG_WR_RATE_CREDIT_LIMIT 0x0100 \
  CONFIG.USER_REG_WR_VCA_TOKEN0 0xFF \
] [get_bd_cells M01_INI_stub_nmu]
create_bd_cell -type ip -vlnv xilinx.com:ip:xlconstant:1.1 stub_clock
create_bd_cell -type ip -vlnv xilinx.com:ip:xlconstant:1.1 no_black_box

# ---- connections ----

# net m00_ini_stub_nmu_if_noc_axi_araddr has one end: M00_INI_stub_nmu/IF_NOC_AXI_ARADDR
# net m00_ini_stub_nmu_if_noc_axi_arburst has one end: M00_INI_stub_nmu/IF_NOC_AXI_ARBURST
# net m00_ini_stub_nmu_if_noc_axi_arcache has one end: M00_INI_stub_nmu/IF_NOC_AXI_ARCACHE
# net m00_ini_stub_nmu_if_noc_axi_arlen has one end: M00_INI_stub_nmu/IF_NOC_AXI_ARLEN
# net m00_ini_stub_nmu_if_noc_axi_arlock has one end: M00_INI_stub_nmu/IF_NOC_AXI_ARLOCK
# net m00_ini_stub_nmu_if_noc_axi_arprot has one end: M00_INI_stub_nmu/IF_NOC_AXI_ARPROT
# net m00_ini_stub_nmu_if_noc_axi_arqos has one end: M00_INI_stub_nmu/IF_NOC_AXI_ARQOS
# net m00_ini_stub_nmu_if_noc_axi_arready has one end: M00_INI_stub_nmu/IF_NOC_AXI_ARREADY
# net m00_ini_stub_nmu_if_noc_axi_arregion has one end: M00_INI_stub_nmu/IF_NOC_AXI_ARREGION
# net m00_ini_stub_nmu_if_noc_axi_arsize has one end: M00_INI_stub_nmu/IF_NOC_AXI_ARSIZE
# net m00_ini_stub_nmu_if_noc_axi_arvalid has one end: M00_INI_stub_nmu/IF_NOC_AXI_ARVALID
# net m00_ini_stub_nmu_if_noc_axi_awaddr has one end: M00_INI_stub_nmu/IF_NOC_AXI_AWADDR
# net m00_ini_stub_nmu_if_noc_axi_awburst has one end: M00_INI_stub_nmu/IF_NOC_AXI_AWBURST
# net m00_ini_stub_nmu_if_noc_axi_awcache has one end: M00_INI_stub_nmu/IF_NOC_AXI_AWCACHE
# net m00_ini_stub_nmu_if_noc_axi_awlen has one end: M00_INI_stub_nmu/IF_NOC_AXI_AWLEN
# net m00_ini_stub_nmu_if_noc_axi_awlock has one end: M00_INI_stub_nmu/IF_NOC_AXI_AWLOCK
# net m00_ini_stub_nmu_if_noc_axi_awprot has one end: M00_INI_stub_nmu/IF_NOC_AXI_AWPROT
# net m00_ini_stub_nmu_if_noc_axi_awqos has one end: M00_INI_stub_nmu/IF_NOC_AXI_AWQOS
# net m00_ini_stub_nmu_if_noc_axi_awready has one end: M00_INI_stub_nmu/IF_NOC_AXI_AWREADY
# net m00_ini_stub_nmu_if_noc_axi_awregion has one end: M00_INI_stub_nmu/IF_NOC_AXI_AWREGION
# net m00_ini_stub_nmu_if_noc_axi_awsize has one end: M00_INI_stub_nmu/IF_NOC_AXI_AWSIZE
# net m00_ini_stub_nmu_if_noc_axi_awvalid has one end: M00_INI_stub_nmu/IF_NOC_AXI_AWVALID
# net m00_ini_stub_nmu_if_noc_axi_bready has one end: M00_INI_stub_nmu/IF_NOC_AXI_BREADY
# net m00_ini_stub_nmu_if_noc_axi_bresp has one end: M00_INI_stub_nmu/IF_NOC_AXI_BRESP
# net m00_ini_stub_nmu_if_noc_axi_bvalid has one end: M00_INI_stub_nmu/IF_NOC_AXI_BVALID
# net m00_ini_stub_nmu_if_noc_axi_rdata has one end: M00_INI_stub_nmu/IF_NOC_AXI_RDATA
# net m00_ini_stub_nmu_if_noc_axi_rlast has one end: M00_INI_stub_nmu/IF_NOC_AXI_RLAST
# net m00_ini_stub_nmu_if_noc_axi_rready has one end: M00_INI_stub_nmu/IF_NOC_AXI_RREADY
# net m00_ini_stub_nmu_if_noc_axi_rresp has one end: M00_INI_stub_nmu/IF_NOC_AXI_RRESP
# net m00_ini_stub_nmu_if_noc_axi_rvalid has one end: M00_INI_stub_nmu/IF_NOC_AXI_RVALID
# net m00_ini_stub_nmu_if_noc_axi_wdata has one end: M00_INI_stub_nmu/IF_NOC_AXI_WDATA
# net m00_ini_stub_nmu_if_noc_axi_wlast has one end: M00_INI_stub_nmu/IF_NOC_AXI_WLAST
# net m00_ini_stub_nmu_if_noc_axi_wready has one end: M00_INI_stub_nmu/IF_NOC_AXI_WREADY
# net m00_ini_stub_nmu_if_noc_axi_wstrb has one end: M00_INI_stub_nmu/IF_NOC_AXI_WSTRB
# net m00_ini_stub_nmu_if_noc_axi_wvalid has one end: M00_INI_stub_nmu/IF_NOC_AXI_WVALID
# net m00_ini_stub_nmu_if_noc_npp_in_noc_credit_rdy has one end: M00_INI_stub_nmu/IF_NOC_NPP_IN_NOC_CREDIT_RDY
# net m00_ini_stub_nmu_if_noc_npp_in_noc_credit_return has one end: M00_INI_stub_nmu/IF_NOC_NPP_IN_NOC_CREDIT_RETURN
# net m00_ini_stub_nmu_if_noc_npp_in_noc_flit has one end: M00_INI_stub_nmu/IF_NOC_NPP_IN_NOC_FLIT
# net m00_ini_stub_nmu_if_noc_npp_in_noc_valid has one end: M00_INI_stub_nmu/IF_NOC_NPP_IN_NOC_VALID
# net m00_ini_stub_nmu_if_noc_npp_out_noc_credit_rdy has one end: M00_INI_stub_nmu/IF_NOC_NPP_OUT_NOC_CREDIT_RDY
# net m00_ini_stub_nmu_if_noc_npp_out_noc_credit_return has one end: M00_INI_stub_nmu/IF_NOC_NPP_OUT_NOC_CREDIT_RETURN
# net m00_ini_stub_nmu_if_noc_npp_out_noc_flit has one end: M00_INI_stub_nmu/IF_NOC_NPP_OUT_NOC_FLIT
# net m00_ini_stub_nmu_if_noc_npp_out_noc_valid has one end: M00_INI_stub_nmu/IF_NOC_NPP_OUT_NOC_VALID
# net m01_ini_stub_nmu_if_noc_axi_araddr has one end: M01_INI_stub_nmu/IF_NOC_AXI_ARADDR
# net m01_ini_stub_nmu_if_noc_axi_arburst has one end: M01_INI_stub_nmu/IF_NOC_AXI_ARBURST
# net m01_ini_stub_nmu_if_noc_axi_arcache has one end: M01_INI_stub_nmu/IF_NOC_AXI_ARCACHE
# net m01_ini_stub_nmu_if_noc_axi_arlen has one end: M01_INI_stub_nmu/IF_NOC_AXI_ARLEN
# net m01_ini_stub_nmu_if_noc_axi_arlock has one end: M01_INI_stub_nmu/IF_NOC_AXI_ARLOCK
# net m01_ini_stub_nmu_if_noc_axi_arprot has one end: M01_INI_stub_nmu/IF_NOC_AXI_ARPROT
# net m01_ini_stub_nmu_if_noc_axi_arqos has one end: M01_INI_stub_nmu/IF_NOC_AXI_ARQOS
# net m01_ini_stub_nmu_if_noc_axi_arready has one end: M01_INI_stub_nmu/IF_NOC_AXI_ARREADY
# net m01_ini_stub_nmu_if_noc_axi_arregion has one end: M01_INI_stub_nmu/IF_NOC_AXI_ARREGION
# net m01_ini_stub_nmu_if_noc_axi_arsize has one end: M01_INI_stub_nmu/IF_NOC_AXI_ARSIZE
# net m01_ini_stub_nmu_if_noc_axi_arvalid has one end: M01_INI_stub_nmu/IF_NOC_AXI_ARVALID
# net m01_ini_stub_nmu_if_noc_axi_awaddr has one end: M01_INI_stub_nmu/IF_NOC_AXI_AWADDR
# net m01_ini_stub_nmu_if_noc_axi_awburst has one end: M01_INI_stub_nmu/IF_NOC_AXI_AWBURST
# net m01_ini_stub_nmu_if_noc_axi_awcache has one end: M01_INI_stub_nmu/IF_NOC_AXI_AWCACHE
# net m01_ini_stub_nmu_if_noc_axi_awlen has one end: M01_INI_stub_nmu/IF_NOC_AXI_AWLEN
# net m01_ini_stub_nmu_if_noc_axi_awlock has one end: M01_INI_stub_nmu/IF_NOC_AXI_AWLOCK
# net m01_ini_stub_nmu_if_noc_axi_awprot has one end: M01_INI_stub_nmu/IF_NOC_AXI_AWPROT
# net m01_ini_stub_nmu_if_noc_axi_awqos has one end: M01_INI_stub_nmu/IF_NOC_AXI_AWQOS
# net m01_ini_stub_nmu_if_noc_axi_awready has one end: M01_INI_stub_nmu/IF_NOC_AXI_AWREADY
# net m01_ini_stub_nmu_if_noc_axi_awregion has one end: M01_INI_stub_nmu/IF_NOC_AXI_AWREGION
# net m01_ini_stub_nmu_if_noc_axi_awsize has one end: M01_INI_stub_nmu/IF_NOC_AXI_AWSIZE
# net m01_ini_stub_nmu_if_noc_axi_awvalid has one end: M01_INI_stub_nmu/IF_NOC_AXI_AWVALID
# net m01_ini_stub_nmu_if_noc_axi_bready has one end: M01_INI_stub_nmu/IF_NOC_AXI_BREADY
# net m01_ini_stub_nmu_if_noc_axi_bresp has one end: M01_INI_stub_nmu/IF_NOC_AXI_BRESP
# net m01_ini_stub_nmu_if_noc_axi_bvalid has one end: M01_INI_stub_nmu/IF_NOC_AXI_BVALID
# net m01_ini_stub_nmu_if_noc_axi_rdata has one end: M01_INI_stub_nmu/IF_NOC_AXI_RDATA
# net m01_ini_stub_nmu_if_noc_axi_rlast has one end: M01_INI_stub_nmu/IF_NOC_AXI_RLAST
# net m01_ini_stub_nmu_if_noc_axi_rready has one end: M01_INI_stub_nmu/IF_NOC_AXI_RREADY
# net m01_ini_stub_nmu_if_noc_axi_rresp has one end: M01_INI_stub_nmu/IF_NOC_AXI_RRESP
# net m01_ini_stub_nmu_if_noc_axi_rvalid has one end: M01_INI_stub_nmu/IF_NOC_AXI_RVALID
# net m01_ini_stub_nmu_if_noc_axi_wdata has one end: M01_INI_stub_nmu/IF_NOC_AXI_WDATA
# net m01_ini_stub_nmu_if_noc_axi_wlast has one end: M01_INI_stub_nmu/IF_NOC_AXI_WLAST
# net m01_ini_stub_nmu_if_noc_axi_wready has one end: M01_INI_stub_nmu/IF_NOC_AXI_WREADY
# net m01_ini_stub_nmu_if_noc_axi_wstrb has one end: M01_INI_stub_nmu/IF_NOC_AXI_WSTRB
# net m01_ini_stub_nmu_if_noc_axi_wvalid has one end: M01_INI_stub_nmu/IF_NOC_AXI_WVALID
# net m01_ini_stub_nmu_if_noc_npp_in_noc_credit_rdy has one end: M01_INI_stub_nmu/IF_NOC_NPP_IN_NOC_CREDIT_RDY
# net m01_ini_stub_nmu_if_noc_npp_in_noc_credit_return has one end: M01_INI_stub_nmu/IF_NOC_NPP_IN_NOC_CREDIT_RETURN
# net m01_ini_stub_nmu_if_noc_npp_in_noc_flit has one end: M01_INI_stub_nmu/IF_NOC_NPP_IN_NOC_FLIT
# net m01_ini_stub_nmu_if_noc_npp_in_noc_valid has one end: M01_INI_stub_nmu/IF_NOC_NPP_IN_NOC_VALID
# net m01_ini_stub_nmu_if_noc_npp_out_noc_credit_rdy has one end: M01_INI_stub_nmu/IF_NOC_NPP_OUT_NOC_CREDIT_RDY
# net m01_ini_stub_nmu_if_noc_npp_out_noc_credit_return has one end: M01_INI_stub_nmu/IF_NOC_NPP_OUT_NOC_CREDIT_RETURN
# net m01_ini_stub_nmu_if_noc_npp_out_noc_flit has one end: M01_INI_stub_nmu/IF_NOC_NPP_OUT_NOC_FLIT
# net m01_ini_stub_nmu_if_noc_npp_out_noc_valid has one end: M01_INI_stub_nmu/IF_NOC_NPP_OUT_NOC_VALID
# net m02_ini_stub_nmu_if_noc_axi_araddr has one end: M02_INI_stub_nmu/IF_NOC_AXI_ARADDR
# net m02_ini_stub_nmu_if_noc_axi_arburst has one end: M02_INI_stub_nmu/IF_NOC_AXI_ARBURST
# net m02_ini_stub_nmu_if_noc_axi_arcache has one end: M02_INI_stub_nmu/IF_NOC_AXI_ARCACHE
# net m02_ini_stub_nmu_if_noc_axi_arlen has one end: M02_INI_stub_nmu/IF_NOC_AXI_ARLEN
# net m02_ini_stub_nmu_if_noc_axi_arlock has one end: M02_INI_stub_nmu/IF_NOC_AXI_ARLOCK
# net m02_ini_stub_nmu_if_noc_axi_arprot has one end: M02_INI_stub_nmu/IF_NOC_AXI_ARPROT
# net m02_ini_stub_nmu_if_noc_axi_arqos has one end: M02_INI_stub_nmu/IF_NOC_AXI_ARQOS
# net m02_ini_stub_nmu_if_noc_axi_arready has one end: M02_INI_stub_nmu/IF_NOC_AXI_ARREADY
# net m02_ini_stub_nmu_if_noc_axi_arregion has one end: M02_INI_stub_nmu/IF_NOC_AXI_ARREGION
# net m02_ini_stub_nmu_if_noc_axi_arsize has one end: M02_INI_stub_nmu/IF_NOC_AXI_ARSIZE
# net m02_ini_stub_nmu_if_noc_axi_arvalid has one end: M02_INI_stub_nmu/IF_NOC_AXI_ARVALID
# net m02_ini_stub_nmu_if_noc_axi_awaddr has one end: M02_INI_stub_nmu/IF_NOC_AXI_AWADDR
# net m02_ini_stub_nmu_if_noc_axi_awburst has one end: M02_INI_stub_nmu/IF_NOC_AXI_AWBURST
# net m02_ini_stub_nmu_if_noc_axi_awcache has one end: M02_INI_stub_nmu/IF_NOC_AXI_AWCACHE
# net m02_ini_stub_nmu_if_noc_axi_awlen has one end: M02_INI_stub_nmu/IF_NOC_AXI_AWLEN
# net m02_ini_stub_nmu_if_noc_axi_awlock has one end: M02_INI_stub_nmu/IF_NOC_AXI_AWLOCK
# net m02_ini_stub_nmu_if_noc_axi_awprot has one end: M02_INI_stub_nmu/IF_NOC_AXI_AWPROT
# net m02_ini_stub_nmu_if_noc_axi_awqos has one end: M02_INI_stub_nmu/IF_NOC_AXI_AWQOS
# net m02_ini_stub_nmu_if_noc_axi_awready has one end: M02_INI_stub_nmu/IF_NOC_AXI_AWREADY
# net m02_ini_stub_nmu_if_noc_axi_awregion has one end: M02_INI_stub_nmu/IF_NOC_AXI_AWREGION
# net m02_ini_stub_nmu_if_noc_axi_awsize has one end: M02_INI_stub_nmu/IF_NOC_AXI_AWSIZE
# net m02_ini_stub_nmu_if_noc_axi_awvalid has one end: M02_INI_stub_nmu/IF_NOC_AXI_AWVALID
# net m02_ini_stub_nmu_if_noc_axi_bready has one end: M02_INI_stub_nmu/IF_NOC_AXI_BREADY
# net m02_ini_stub_nmu_if_noc_axi_bresp has one end: M02_INI_stub_nmu/IF_NOC_AXI_BRESP
# net m02_ini_stub_nmu_if_noc_axi_bvalid has one end: M02_INI_stub_nmu/IF_NOC_AXI_BVALID
# net m02_ini_stub_nmu_if_noc_axi_rdata has one end: M02_INI_stub_nmu/IF_NOC_AXI_RDATA
# net m02_ini_stub_nmu_if_noc_axi_rlast has one end: M02_INI_stub_nmu/IF_NOC_AXI_RLAST
# net m02_ini_stub_nmu_if_noc_axi_rready has one end: M02_INI_stub_nmu/IF_NOC_AXI_RREADY
# net m02_ini_stub_nmu_if_noc_axi_rresp has one end: M02_INI_stub_nmu/IF_NOC_AXI_RRESP
# net m02_ini_stub_nmu_if_noc_axi_rvalid has one end: M02_INI_stub_nmu/IF_NOC_AXI_RVALID
# net m02_ini_stub_nmu_if_noc_axi_wdata has one end: M02_INI_stub_nmu/IF_NOC_AXI_WDATA
# net m02_ini_stub_nmu_if_noc_axi_wlast has one end: M02_INI_stub_nmu/IF_NOC_AXI_WLAST
# net m02_ini_stub_nmu_if_noc_axi_wready has one end: M02_INI_stub_nmu/IF_NOC_AXI_WREADY
# net m02_ini_stub_nmu_if_noc_axi_wstrb has one end: M02_INI_stub_nmu/IF_NOC_AXI_WSTRB
# net m02_ini_stub_nmu_if_noc_axi_wvalid has one end: M02_INI_stub_nmu/IF_NOC_AXI_WVALID
# net m02_ini_stub_nmu_if_noc_npp_in_noc_credit_rdy has one end: M02_INI_stub_nmu/IF_NOC_NPP_IN_NOC_CREDIT_RDY
# net m02_ini_stub_nmu_if_noc_npp_in_noc_credit_return has one end: M02_INI_stub_nmu/IF_NOC_NPP_IN_NOC_CREDIT_RETURN
# net m02_ini_stub_nmu_if_noc_npp_in_noc_flit has one end: M02_INI_stub_nmu/IF_NOC_NPP_IN_NOC_FLIT
# net m02_ini_stub_nmu_if_noc_npp_in_noc_valid has one end: M02_INI_stub_nmu/IF_NOC_NPP_IN_NOC_VALID
# net m02_ini_stub_nmu_if_noc_npp_out_noc_credit_rdy has one end: M02_INI_stub_nmu/IF_NOC_NPP_OUT_NOC_CREDIT_RDY
# net m02_ini_stub_nmu_if_noc_npp_out_noc_credit_return has one end: M02_INI_stub_nmu/IF_NOC_NPP_OUT_NOC_CREDIT_RETURN
# net m02_ini_stub_nmu_if_noc_npp_out_noc_flit has one end: M02_INI_stub_nmu/IF_NOC_NPP_OUT_NOC_FLIT
# net m02_ini_stub_nmu_if_noc_npp_out_noc_valid has one end: M02_INI_stub_nmu/IF_NOC_NPP_OUT_NOC_VALID
connect_bd_net [get_bd_pins stub_clock/dout] \
  [get_bd_pins M02_INI_stub_nmu/aclk] [get_bd_pins M00_INI_stub_nmu/aclk] [get_bd_pins M01_INI_stub_nmu/aclk]
set_property HDL_ATTRIBUTE.DONT_TOUCH true [get_bd_cells M02_INI_stub_nmu]
set_property HDL_ATTRIBUTE.DONT_TOUCH true [get_bd_cells M00_INI_stub_nmu]
set_property HDL_ATTRIBUTE.DONT_TOUCH true [get_bd_cells M01_INI_stub_nmu]
set_property HDL_ATTRIBUTE.DONT_TOUCH true [get_bd_cells stub_clock]
set_property HDL_ATTRIBUTE.DONT_TOUCH true [get_bd_cells no_black_box]
set_property HDL_ATTRIBUTE.EXT_CONN TRUE [get_bd_nets m00_ini_stub_nmu_if_noc_axi_araddr]
set_property HDL_ATTRIBUTE.HIDDEN TRUE [get_bd_nets m00_ini_stub_nmu_if_noc_axi_araddr]
set_property HDL_ATTRIBUTE.SIM_ONLY TRUE [get_bd_nets m00_ini_stub_nmu_if_noc_axi_araddr]
set_property HDL_ATTRIBUTE.EXT_CONN TRUE [get_bd_nets m00_ini_stub_nmu_if_noc_axi_arburst]
set_property HDL_ATTRIBUTE.HIDDEN TRUE [get_bd_nets m00_ini_stub_nmu_if_noc_axi_arburst]
set_property HDL_ATTRIBUTE.SIM_ONLY TRUE [get_bd_nets m00_ini_stub_nmu_if_noc_axi_arburst]
set_property HDL_ATTRIBUTE.EXT_CONN TRUE [get_bd_nets m00_ini_stub_nmu_if_noc_axi_arcache]
set_property HDL_ATTRIBUTE.HIDDEN TRUE [get_bd_nets m00_ini_stub_nmu_if_noc_axi_arcache]
set_property HDL_ATTRIBUTE.SIM_ONLY TRUE [get_bd_nets m00_ini_stub_nmu_if_noc_axi_arcache]
set_property HDL_ATTRIBUTE.EXT_CONN TRUE [get_bd_nets m00_ini_stub_nmu_if_noc_axi_arlen]
set_property HDL_ATTRIBUTE.HIDDEN TRUE [get_bd_nets m00_ini_stub_nmu_if_noc_axi_arlen]
set_property HDL_ATTRIBUTE.SIM_ONLY TRUE [get_bd_nets m00_ini_stub_nmu_if_noc_axi_arlen]
set_property HDL_ATTRIBUTE.EXT_CONN TRUE [get_bd_nets m00_ini_stub_nmu_if_noc_axi_arlock]
set_property HDL_ATTRIBUTE.HIDDEN TRUE [get_bd_nets m00_ini_stub_nmu_if_noc_axi_arlock]
set_property HDL_ATTRIBUTE.SIM_ONLY TRUE [get_bd_nets m00_ini_stub_nmu_if_noc_axi_arlock]
set_property HDL_ATTRIBUTE.EXT_CONN TRUE [get_bd_nets m00_ini_stub_nmu_if_noc_axi_arprot]
set_property HDL_ATTRIBUTE.HIDDEN TRUE [get_bd_nets m00_ini_stub_nmu_if_noc_axi_arprot]
set_property HDL_ATTRIBUTE.SIM_ONLY TRUE [get_bd_nets m00_ini_stub_nmu_if_noc_axi_arprot]
set_property HDL_ATTRIBUTE.EXT_CONN TRUE [get_bd_nets m00_ini_stub_nmu_if_noc_axi_arqos]
set_property HDL_ATTRIBUTE.HIDDEN TRUE [get_bd_nets m00_ini_stub_nmu_if_noc_axi_arqos]
set_property HDL_ATTRIBUTE.SIM_ONLY TRUE [get_bd_nets m00_ini_stub_nmu_if_noc_axi_arqos]
set_property HDL_ATTRIBUTE.EXT_CONN TRUE [get_bd_nets m00_ini_stub_nmu_if_noc_axi_arready]
set_property HDL_ATTRIBUTE.HIDDEN TRUE [get_bd_nets m00_ini_stub_nmu_if_noc_axi_arready]
set_property HDL_ATTRIBUTE.SIM_ONLY TRUE [get_bd_nets m00_ini_stub_nmu_if_noc_axi_arready]
set_property HDL_ATTRIBUTE.EXT_CONN TRUE [get_bd_nets m00_ini_stub_nmu_if_noc_axi_arregion]
set_property HDL_ATTRIBUTE.HIDDEN TRUE [get_bd_nets m00_ini_stub_nmu_if_noc_axi_arregion]
set_property HDL_ATTRIBUTE.SIM_ONLY TRUE [get_bd_nets m00_ini_stub_nmu_if_noc_axi_arregion]
set_property HDL_ATTRIBUTE.EXT_CONN TRUE [get_bd_nets m00_ini_stub_nmu_if_noc_axi_arsize]
set_property HDL_ATTRIBUTE.HIDDEN TRUE [get_bd_nets m00_ini_stub_nmu_if_noc_axi_arsize]
set_property HDL_ATTRIBUTE.SIM_ONLY TRUE [get_bd_nets m00_ini_stub_nmu_if_noc_axi_arsize]
set_property HDL_ATTRIBUTE.EXT_CONN TRUE [get_bd_nets m00_ini_stub_nmu_if_noc_axi_arvalid]
set_property HDL_ATTRIBUTE.HIDDEN TRUE [get_bd_nets m00_ini_stub_nmu_if_noc_axi_arvalid]
set_property HDL_ATTRIBUTE.SIM_ONLY TRUE [get_bd_nets m00_ini_stub_nmu_if_noc_axi_arvalid]
set_property HDL_ATTRIBUTE.EXT_CONN TRUE [get_bd_nets m00_ini_stub_nmu_if_noc_axi_awaddr]
set_property HDL_ATTRIBUTE.HIDDEN TRUE [get_bd_nets m00_ini_stub_nmu_if_noc_axi_awaddr]
set_property HDL_ATTRIBUTE.SIM_ONLY TRUE [get_bd_nets m00_ini_stub_nmu_if_noc_axi_awaddr]
set_property HDL_ATTRIBUTE.EXT_CONN TRUE [get_bd_nets m00_ini_stub_nmu_if_noc_axi_awburst]
set_property HDL_ATTRIBUTE.HIDDEN TRUE [get_bd_nets m00_ini_stub_nmu_if_noc_axi_awburst]
set_property HDL_ATTRIBUTE.SIM_ONLY TRUE [get_bd_nets m00_ini_stub_nmu_if_noc_axi_awburst]
set_property HDL_ATTRIBUTE.EXT_CONN TRUE [get_bd_nets m00_ini_stub_nmu_if_noc_axi_awcache]
set_property HDL_ATTRIBUTE.HIDDEN TRUE [get_bd_nets m00_ini_stub_nmu_if_noc_axi_awcache]
set_property HDL_ATTRIBUTE.SIM_ONLY TRUE [get_bd_nets m00_ini_stub_nmu_if_noc_axi_awcache]
set_property HDL_ATTRIBUTE.EXT_CONN TRUE [get_bd_nets m00_ini_stub_nmu_if_noc_axi_awlen]
set_property HDL_ATTRIBUTE.HIDDEN TRUE [get_bd_nets m00_ini_stub_nmu_if_noc_axi_awlen]
set_property HDL_ATTRIBUTE.SIM_ONLY TRUE [get_bd_nets m00_ini_stub_nmu_if_noc_axi_awlen]
set_property HDL_ATTRIBUTE.EXT_CONN TRUE [get_bd_nets m00_ini_stub_nmu_if_noc_axi_awlock]
set_property HDL_ATTRIBUTE.HIDDEN TRUE [get_bd_nets m00_ini_stub_nmu_if_noc_axi_awlock]
set_property HDL_ATTRIBUTE.SIM_ONLY TRUE [get_bd_nets m00_ini_stub_nmu_if_noc_axi_awlock]
set_property HDL_ATTRIBUTE.EXT_CONN TRUE [get_bd_nets m00_ini_stub_nmu_if_noc_axi_awprot]
set_property HDL_ATTRIBUTE.HIDDEN TRUE [get_bd_nets m00_ini_stub_nmu_if_noc_axi_awprot]
set_property HDL_ATTRIBUTE.SIM_ONLY TRUE [get_bd_nets m00_ini_stub_nmu_if_noc_axi_awprot]
set_property HDL_ATTRIBUTE.EXT_CONN TRUE [get_bd_nets m00_ini_stub_nmu_if_noc_axi_awqos]
set_property HDL_ATTRIBUTE.HIDDEN TRUE [get_bd_nets m00_ini_stub_nmu_if_noc_axi_awqos]
set_property HDL_ATTRIBUTE.SIM_ONLY TRUE [get_bd_nets m00_ini_stub_nmu_if_noc_axi_awqos]
set_property HDL_ATTRIBUTE.EXT_CONN TRUE [get_bd_nets m00_ini_stub_nmu_if_noc_axi_awready]
set_property HDL_ATTRIBUTE.HIDDEN TRUE [get_bd_nets m00_ini_stub_nmu_if_noc_axi_awready]
set_property HDL_ATTRIBUTE.SIM_ONLY TRUE [get_bd_nets m00_ini_stub_nmu_if_noc_axi_awready]
set_property HDL_ATTRIBUTE.EXT_CONN TRUE [get_bd_nets m00_ini_stub_nmu_if_noc_axi_awregion]
set_property HDL_ATTRIBUTE.HIDDEN TRUE [get_bd_nets m00_ini_stub_nmu_if_noc_axi_awregion]
set_property HDL_ATTRIBUTE.SIM_ONLY TRUE [get_bd_nets m00_ini_stub_nmu_if_noc_axi_awregion]
set_property HDL_ATTRIBUTE.EXT_CONN TRUE [get_bd_nets m00_ini_stub_nmu_if_noc_axi_awsize]
set_property HDL_ATTRIBUTE.HIDDEN TRUE [get_bd_nets m00_ini_stub_nmu_if_noc_axi_awsize]
set_property HDL_ATTRIBUTE.SIM_ONLY TRUE [get_bd_nets m00_ini_stub_nmu_if_noc_axi_awsize]
set_property HDL_ATTRIBUTE.EXT_CONN TRUE [get_bd_nets m00_ini_stub_nmu_if_noc_axi_awvalid]
set_property HDL_ATTRIBUTE.HIDDEN TRUE [get_bd_nets m00_ini_stub_nmu_if_noc_axi_awvalid]
set_property HDL_ATTRIBUTE.SIM_ONLY TRUE [get_bd_nets m00_ini_stub_nmu_if_noc_axi_awvalid]
set_property HDL_ATTRIBUTE.EXT_CONN TRUE [get_bd_nets m00_ini_stub_nmu_if_noc_axi_bready]
set_property HDL_ATTRIBUTE.HIDDEN TRUE [get_bd_nets m00_ini_stub_nmu_if_noc_axi_bready]
set_property HDL_ATTRIBUTE.SIM_ONLY TRUE [get_bd_nets m00_ini_stub_nmu_if_noc_axi_bready]
set_property HDL_ATTRIBUTE.EXT_CONN TRUE [get_bd_nets m00_ini_stub_nmu_if_noc_axi_bresp]
set_property HDL_ATTRIBUTE.HIDDEN TRUE [get_bd_nets m00_ini_stub_nmu_if_noc_axi_bresp]
set_property HDL_ATTRIBUTE.SIM_ONLY TRUE [get_bd_nets m00_ini_stub_nmu_if_noc_axi_bresp]
set_property HDL_ATTRIBUTE.EXT_CONN TRUE [get_bd_nets m00_ini_stub_nmu_if_noc_axi_bvalid]
set_property HDL_ATTRIBUTE.HIDDEN TRUE [get_bd_nets m00_ini_stub_nmu_if_noc_axi_bvalid]
set_property HDL_ATTRIBUTE.SIM_ONLY TRUE [get_bd_nets m00_ini_stub_nmu_if_noc_axi_bvalid]
set_property HDL_ATTRIBUTE.EXT_CONN TRUE [get_bd_nets m00_ini_stub_nmu_if_noc_axi_rdata]
set_property HDL_ATTRIBUTE.HIDDEN TRUE [get_bd_nets m00_ini_stub_nmu_if_noc_axi_rdata]
set_property HDL_ATTRIBUTE.SIM_ONLY TRUE [get_bd_nets m00_ini_stub_nmu_if_noc_axi_rdata]
set_property HDL_ATTRIBUTE.EXT_CONN TRUE [get_bd_nets m00_ini_stub_nmu_if_noc_axi_rlast]
set_property HDL_ATTRIBUTE.HIDDEN TRUE [get_bd_nets m00_ini_stub_nmu_if_noc_axi_rlast]
set_property HDL_ATTRIBUTE.SIM_ONLY TRUE [get_bd_nets m00_ini_stub_nmu_if_noc_axi_rlast]
set_property HDL_ATTRIBUTE.EXT_CONN TRUE [get_bd_nets m00_ini_stub_nmu_if_noc_axi_rready]
set_property HDL_ATTRIBUTE.HIDDEN TRUE [get_bd_nets m00_ini_stub_nmu_if_noc_axi_rready]
set_property HDL_ATTRIBUTE.SIM_ONLY TRUE [get_bd_nets m00_ini_stub_nmu_if_noc_axi_rready]
set_property HDL_ATTRIBUTE.EXT_CONN TRUE [get_bd_nets m00_ini_stub_nmu_if_noc_axi_rresp]
set_property HDL_ATTRIBUTE.HIDDEN TRUE [get_bd_nets m00_ini_stub_nmu_if_noc_axi_rresp]
set_property HDL_ATTRIBUTE.SIM_ONLY TRUE [get_bd_nets m00_ini_stub_nmu_if_noc_axi_rresp]
set_property HDL_ATTRIBUTE.EXT_CONN TRUE [get_bd_nets m00_ini_stub_nmu_if_noc_axi_rvalid]
set_property HDL_ATTRIBUTE.HIDDEN TRUE [get_bd_nets m00_ini_stub_nmu_if_noc_axi_rvalid]
set_property HDL_ATTRIBUTE.SIM_ONLY TRUE [get_bd_nets m00_ini_stub_nmu_if_noc_axi_rvalid]
set_property HDL_ATTRIBUTE.EXT_CONN TRUE [get_bd_nets m00_ini_stub_nmu_if_noc_axi_wdata]
set_property HDL_ATTRIBUTE.HIDDEN TRUE [get_bd_nets m00_ini_stub_nmu_if_noc_axi_wdata]
set_property HDL_ATTRIBUTE.SIM_ONLY TRUE [get_bd_nets m00_ini_stub_nmu_if_noc_axi_wdata]
set_property HDL_ATTRIBUTE.EXT_CONN TRUE [get_bd_nets m00_ini_stub_nmu_if_noc_axi_wlast]
set_property HDL_ATTRIBUTE.HIDDEN TRUE [get_bd_nets m00_ini_stub_nmu_if_noc_axi_wlast]
set_property HDL_ATTRIBUTE.SIM_ONLY TRUE [get_bd_nets m00_ini_stub_nmu_if_noc_axi_wlast]
set_property HDL_ATTRIBUTE.EXT_CONN TRUE [get_bd_nets m00_ini_stub_nmu_if_noc_axi_wready]
set_property HDL_ATTRIBUTE.HIDDEN TRUE [get_bd_nets m00_ini_stub_nmu_if_noc_axi_wready]
set_property HDL_ATTRIBUTE.SIM_ONLY TRUE [get_bd_nets m00_ini_stub_nmu_if_noc_axi_wready]
set_property HDL_ATTRIBUTE.EXT_CONN TRUE [get_bd_nets m00_ini_stub_nmu_if_noc_axi_wstrb]
set_property HDL_ATTRIBUTE.HIDDEN TRUE [get_bd_nets m00_ini_stub_nmu_if_noc_axi_wstrb]
set_property HDL_ATTRIBUTE.SIM_ONLY TRUE [get_bd_nets m00_ini_stub_nmu_if_noc_axi_wstrb]
set_property HDL_ATTRIBUTE.EXT_CONN TRUE [get_bd_nets m00_ini_stub_nmu_if_noc_axi_wvalid]
set_property HDL_ATTRIBUTE.HIDDEN TRUE [get_bd_nets m00_ini_stub_nmu_if_noc_axi_wvalid]
set_property HDL_ATTRIBUTE.SIM_ONLY TRUE [get_bd_nets m00_ini_stub_nmu_if_noc_axi_wvalid]
set_property HDL_ATTRIBUTE.EXT_CONN TRUE [get_bd_nets m00_ini_stub_nmu_if_noc_npp_in_noc_credit_rdy]
set_property HDL_ATTRIBUTE.HIDDEN TRUE [get_bd_nets m00_ini_stub_nmu_if_noc_npp_in_noc_credit_rdy]
set_property HDL_ATTRIBUTE.SIM_ONLY TRUE [get_bd_nets m00_ini_stub_nmu_if_noc_npp_in_noc_credit_rdy]
set_property HDL_ATTRIBUTE.EXT_CONN TRUE [get_bd_nets m00_ini_stub_nmu_if_noc_npp_in_noc_credit_return]
set_property HDL_ATTRIBUTE.HIDDEN TRUE [get_bd_nets m00_ini_stub_nmu_if_noc_npp_in_noc_credit_return]
set_property HDL_ATTRIBUTE.SIM_ONLY TRUE [get_bd_nets m00_ini_stub_nmu_if_noc_npp_in_noc_credit_return]
set_property HDL_ATTRIBUTE.EXT_CONN TRUE [get_bd_nets m00_ini_stub_nmu_if_noc_npp_in_noc_flit]
set_property HDL_ATTRIBUTE.HIDDEN TRUE [get_bd_nets m00_ini_stub_nmu_if_noc_npp_in_noc_flit]
set_property HDL_ATTRIBUTE.SIM_ONLY TRUE [get_bd_nets m00_ini_stub_nmu_if_noc_npp_in_noc_flit]
set_property HDL_ATTRIBUTE.EXT_CONN TRUE [get_bd_nets m00_ini_stub_nmu_if_noc_npp_in_noc_valid]
set_property HDL_ATTRIBUTE.HIDDEN TRUE [get_bd_nets m00_ini_stub_nmu_if_noc_npp_in_noc_valid]
set_property HDL_ATTRIBUTE.SIM_ONLY TRUE [get_bd_nets m00_ini_stub_nmu_if_noc_npp_in_noc_valid]
set_property HDL_ATTRIBUTE.EXT_CONN TRUE [get_bd_nets m00_ini_stub_nmu_if_noc_npp_out_noc_credit_rdy]
set_property HDL_ATTRIBUTE.HIDDEN TRUE [get_bd_nets m00_ini_stub_nmu_if_noc_npp_out_noc_credit_rdy]
set_property HDL_ATTRIBUTE.SIM_ONLY TRUE [get_bd_nets m00_ini_stub_nmu_if_noc_npp_out_noc_credit_rdy]
set_property HDL_ATTRIBUTE.EXT_CONN TRUE [get_bd_nets m00_ini_stub_nmu_if_noc_npp_out_noc_credit_return]
set_property HDL_ATTRIBUTE.HIDDEN TRUE [get_bd_nets m00_ini_stub_nmu_if_noc_npp_out_noc_credit_return]
set_property HDL_ATTRIBUTE.SIM_ONLY TRUE [get_bd_nets m00_ini_stub_nmu_if_noc_npp_out_noc_credit_return]
set_property HDL_ATTRIBUTE.EXT_CONN TRUE [get_bd_nets m00_ini_stub_nmu_if_noc_npp_out_noc_flit]
set_property HDL_ATTRIBUTE.HIDDEN TRUE [get_bd_nets m00_ini_stub_nmu_if_noc_npp_out_noc_flit]
set_property HDL_ATTRIBUTE.SIM_ONLY TRUE [get_bd_nets m00_ini_stub_nmu_if_noc_npp_out_noc_flit]
set_property HDL_ATTRIBUTE.EXT_CONN TRUE [get_bd_nets m00_ini_stub_nmu_if_noc_npp_out_noc_valid]
set_property HDL_ATTRIBUTE.HIDDEN TRUE [get_bd_nets m00_ini_stub_nmu_if_noc_npp_out_noc_valid]
set_property HDL_ATTRIBUTE.SIM_ONLY TRUE [get_bd_nets m00_ini_stub_nmu_if_noc_npp_out_noc_valid]
